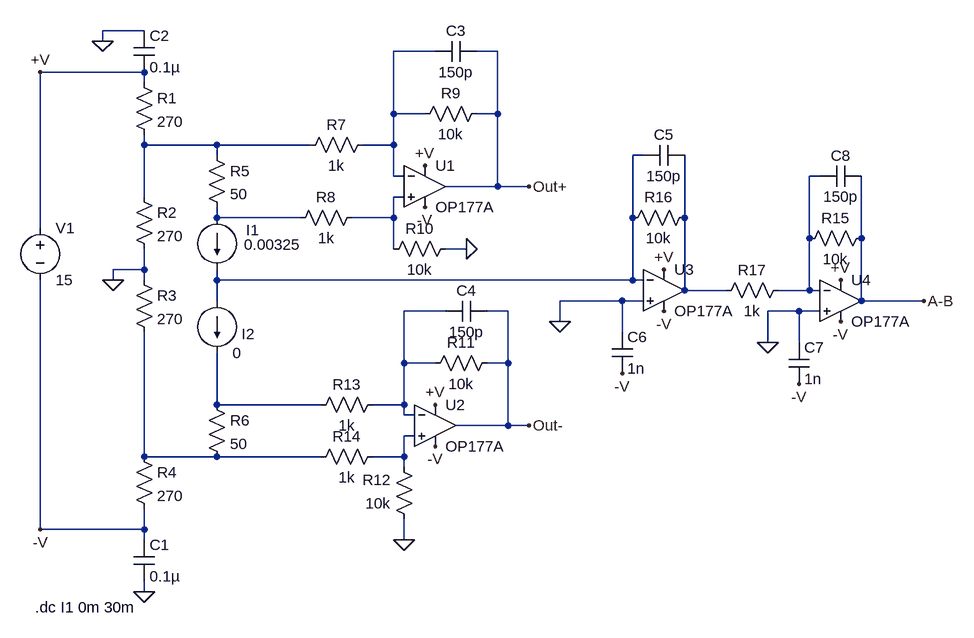
[diagram p0: schematic fotodetectores.asc]
fotodetectores.asc, the LTspice schematic file:
Version 4
SHEET 1 1356 824
WIRE 96 -80 32 -80
WIRE 32 -64 32 -80
WIRE 544 -48 480 -48
WIRE 640 -48 608 -48
WIRE 96 -16 -64 -16
WIRE 96 0 96 -16
WIRE 480 48 480 -48
WIRE 528 48 480 48
WIRE 640 48 640 -48
WIRE 640 48 608 48
WIRE 96 96 96 80
WIRE 208 96 96 96
WIRE 352 96 208 96
WIRE 480 96 480 48
WIRE 480 96 432 96
WIRE 208 112 208 96
WIRE 864 112 848 112
WIRE 480 144 480 96
WIRE 496 144 480 144
WIRE 1136 144 1120 144
WIRE 640 160 640 48
WIRE 640 160 560 160
WIRE 688 160 640 160
WIRE 96 176 96 96
WIRE 496 176 480 176
WIRE 208 208 208 192
WIRE 336 208 208 208
WIRE 480 208 480 176
WIRE 480 208 416 208
WIRE 848 208 848 112
WIRE 928 208 928 112
WIRE -64 224 -64 -16
WIRE 1120 240 1120 144
WIRE 1200 240 1200 144
WIRE 480 256 480 208
WIRE 592 256 560 256
WIRE 96 288 96 256
WIRE 96 288 48 288
WIRE 48 304 48 288
WIRE 96 304 96 288
WIRE 208 304 208 288
WIRE 848 304 848 208
WIRE 848 304 208 304
WIRE 864 304 848 304
WIRE 928 320 928 208
WIRE 992 320 928 320
WIRE 1120 320 1120 240
WIRE 1120 320 1072 320
WIRE 1136 320 1120 320
WIRE 208 336 208 304
WIRE 832 336 736 336
WIRE 864 336 832 336
WIRE 1200 336 1200 240
WIRE 1296 336 1200 336
WIRE 560 352 496 352
WIRE 656 352 624 352
WIRE 1104 352 1056 352
WIRE 1136 352 1104 352
WIRE 736 368 736 336
WIRE 832 384 832 336
WIRE 1056 400 1056 352
WIRE 1104 400 1104 352
WIRE 496 432 496 352
WIRE 544 432 496 432
WIRE 656 432 656 352
WIRE 656 432 624 432
WIRE 208 496 208 416
WIRE 368 496 208 496
WIRE 496 496 496 432
WIRE 496 496 448 496
WIRE 496 512 496 496
WIRE 512 512 496 512
WIRE 656 528 656 432
WIRE 656 528 576 528
WIRE 688 528 656 528
WIRE 512 544 496 544
WIRE 96 576 96 384
WIRE 208 576 96 576
WIRE 368 576 208 576
WIRE 496 576 496 544
WIRE 496 576 448 576
WIRE 496 592 496 576
WIRE -64 688 -64 304
WIRE 96 688 96 656
WIRE 96 688 -64 688
WIRE 96 704 96 688
WIRE 496 704 496 672
WIRE 96 784 96 768
FLAG 96 784 0
FLAG 32 -64 0
FLAG 592 256 0
FLAG 496 704 0
FLAG -64 -16 +V
FLAG 544 496 +V
FLAG 528 128 +V
FLAG -64 688 -V
FLAG 544 560 -V
FLAG 528 192 -V
FLAG 688 160 Out+
FLAG 688 528 Out-
FLAG 48 304 0
FLAG 736 368 0
FLAG 1056 400 0
FLAG 1296 336 A-B
FLAG 1168 304 +V
FLAG 896 288 +V
FLAG 896 352 -V
FLAG 832 448 -V
FLAG 1104 464 -V
FLAG 1168 368 -V
SYMBOL res 80 -16 R0
SYMATTR InstName R1
SYMATTR Value 270
SYMBOL res 80 160 R0
SYMATTR InstName R2
SYMATTR Value 270
SYMBOL res 80 288 R0
SYMATTR InstName R3
SYMATTR Value 270
SYMBOL res 80 560 R0
SYMATTR InstName R4
SYMATTR Value 270
SYMBOL voltage -64 208 R0
WINDOW 123 0 0 Left 0
WINDOW 39 0 0 Left 0
SYMATTR InstName V1
SYMATTR Value 15
SYMBOL cap 80 704 R0
SYMATTR InstName C1
SYMATTR Value 0.1µ
SYMBOL cap 80 -80 R0
SYMATTR InstName C2
SYMATTR Value 0.1µ
SYMBOL res 192 96 R0
SYMATTR InstName R5
SYMATTR Value 50
SYMBOL current 208 208 R0
WINDOW 0 45 19 Left 2
WINDOW 3 42 41 Left 2
WINDOW 123 0 0 Left 0
WINDOW 39 0 0 Left 0
SYMATTR InstName I1
SYMATTR Value 0.00325
SYMBOL current 208 336 R0
WINDOW 0 38 51 Left 2
WINDOW 123 0 0 Left 0
WINDOW 39 0 0 Left 0
SYMATTR InstName I2
SYMATTR Value 0
SYMBOL res 192 480 R0
SYMATTR InstName R6
SYMATTR Value 50
SYMBOL res 448 80 R90
WINDOW 0 0 56 VBottom 2
WINDOW 3 32 56 VTop 2
SYMATTR InstName R7
SYMATTR Value 1k
SYMBOL res 432 192 R90
WINDOW 0 0 56 VBottom 2
WINDOW 3 32 56 VTop 2
SYMATTR InstName R8
SYMATTR Value 1k
SYMBOL OpAmps\\OP177A 528 96 R0
SYMATTR InstName U1
SYMBOL res 624 32 R90
WINDOW 0 0 56 VBottom 2
WINDOW 3 32 56 VTop 2
SYMATTR InstName R9
SYMATTR Value 10k
SYMBOL cap 608 -64 R90
WINDOW 0 0 32 VBottom 2
WINDOW 3 32 32 VTop 2
SYMATTR InstName C3
SYMATTR Value 150p
SYMBOL res 576 240 R90
WINDOW 0 0 56 VBottom 2
WINDOW 3 32 56 VTop 2
SYMATTR InstName R10
SYMATTR Value 10k
SYMBOL OpAmps\\OP177A 544 464 R0
SYMATTR InstName U2
SYMBOL res 640 416 R90
WINDOW 0 0 56 VBottom 2
WINDOW 3 32 56 VTop 2
SYMATTR InstName R11
SYMATTR Value 10k
SYMBOL cap 624 336 R90
WINDOW 0 0 32 VBottom 2
WINDOW 3 32 32 VTop 2
SYMATTR InstName C4
SYMATTR Value 150p
SYMBOL res 512 688 R180
WINDOW 0 36 76 Left 2
WINDOW 3 36 40 Left 2
SYMATTR InstName R12
SYMATTR Value 10k
SYMBOL res 464 480 R90
WINDOW 0 0 56 VBottom 2
WINDOW 3 32 56 VTop 2
SYMATTR InstName R13
SYMATTR Value 1k
SYMBOL res 464 560 R90
WINDOW 0 0 56 VBottom 2
WINDOW 3 32 56 VTop 2
SYMATTR InstName R14
SYMATTR Value 1k
SYMBOL res 944 192 R90
WINDOW 0 0 56 VBottom 2
WINDOW 3 32 56 VTop 2
SYMATTR InstName R16
SYMATTR Value 10k
SYMBOL cap 928 96 R90
WINDOW 0 0 32 VBottom 2
WINDOW 3 32 32 VTop 2
SYMATTR InstName C5
SYMATTR Value 150p
SYMBOL OpAmps\\OP177A 896 256 R0
SYMATTR InstName U3
SYMBOL OpAmps\\OP177A 1168 272 R0
SYMATTR InstName U4
SYMBOL cap 816 384 R0
SYMATTR InstName C6
SYMATTR Value 1n
SYMBOL cap 1088 400 R0
SYMATTR InstName C7
SYMATTR Value 1n
SYMBOL res 1216 224 R90
WINDOW 0 0 56 VBottom 2
WINDOW 3 32 56 VTop 2
SYMATTR InstName R15
SYMATTR Value 10k
SYMBOL cap 1200 128 R90
WINDOW 0 0 32 VBottom 2
WINDOW 3 32 32 VTop 2
SYMATTR InstName C8
SYMATTR Value 150p
SYMBOL res 1088 304 R90
WINDOW 0 0 56 VBottom 2
WINDOW 3 32 56 VTop 2
SYMATTR InstName R17
SYMATTR Value 1k
TEXT -72 808 Left 2 !.dc I1 0m 30m

The netlist it stands for:
* fotodetectores.asc
R1 +V N002 270
R2 N002 0 270
R3 0 N011 270
R4 N011 -V 270
V1 +V -V 15
C1 -V 0 0.1µ
C2 0 +V 0.1µ
R5 N002 N006 50
I1 N006 N003 0.00325
I2 N003 N009 0
R6 N009 N011 50
R7 N001 N002 1k
R8 N005 N006 1k
XU1 N005 N001 +V -V Out+ OP177A  ; pins In+ In- V+ V- OUT
R9 Out+ N001 10k
C3 Out+ N001 150p
R10 0 N005 10k
XU2 N010 N008 +V -V Out- OP177A  ; pins In+ In- V+ V- OUT
R11 Out- N008 10k
C4 Out- N008 150p
R12 0 N010 10k
R13 N008 N009 1k
R14 N010 N011 1k
R16 N007 N003 10k
C5 N007 N003 150p
XU3 0 N003 +V -V N007 OP177A  ; pins In+ In- V+ V- OUT
XU4 0 N004 +V -V A-B OP177A  ; pins In+ In- V+ V- OUT
C6 0 -V 1n
C7 0 -V 1n
R15 A-B N004 10k
C8 A-B N004 150p
R17 N004 N007 1k
.dc I1 0m 30m
.backanno
.end